# Altium schematic sheet MAIN.SchDoc
size A4; Engineer: Alisya K.; SheetNumber: 1; SheetTotal: 2; Project: LED Chaser; ENG_APP_DATE: --/--/--; DSN_APP_DATE: --/--/--; CHK_APP_DATE: --/--/--; SchBrief: Running LED lights circuit design.; SchTitle: MAIN
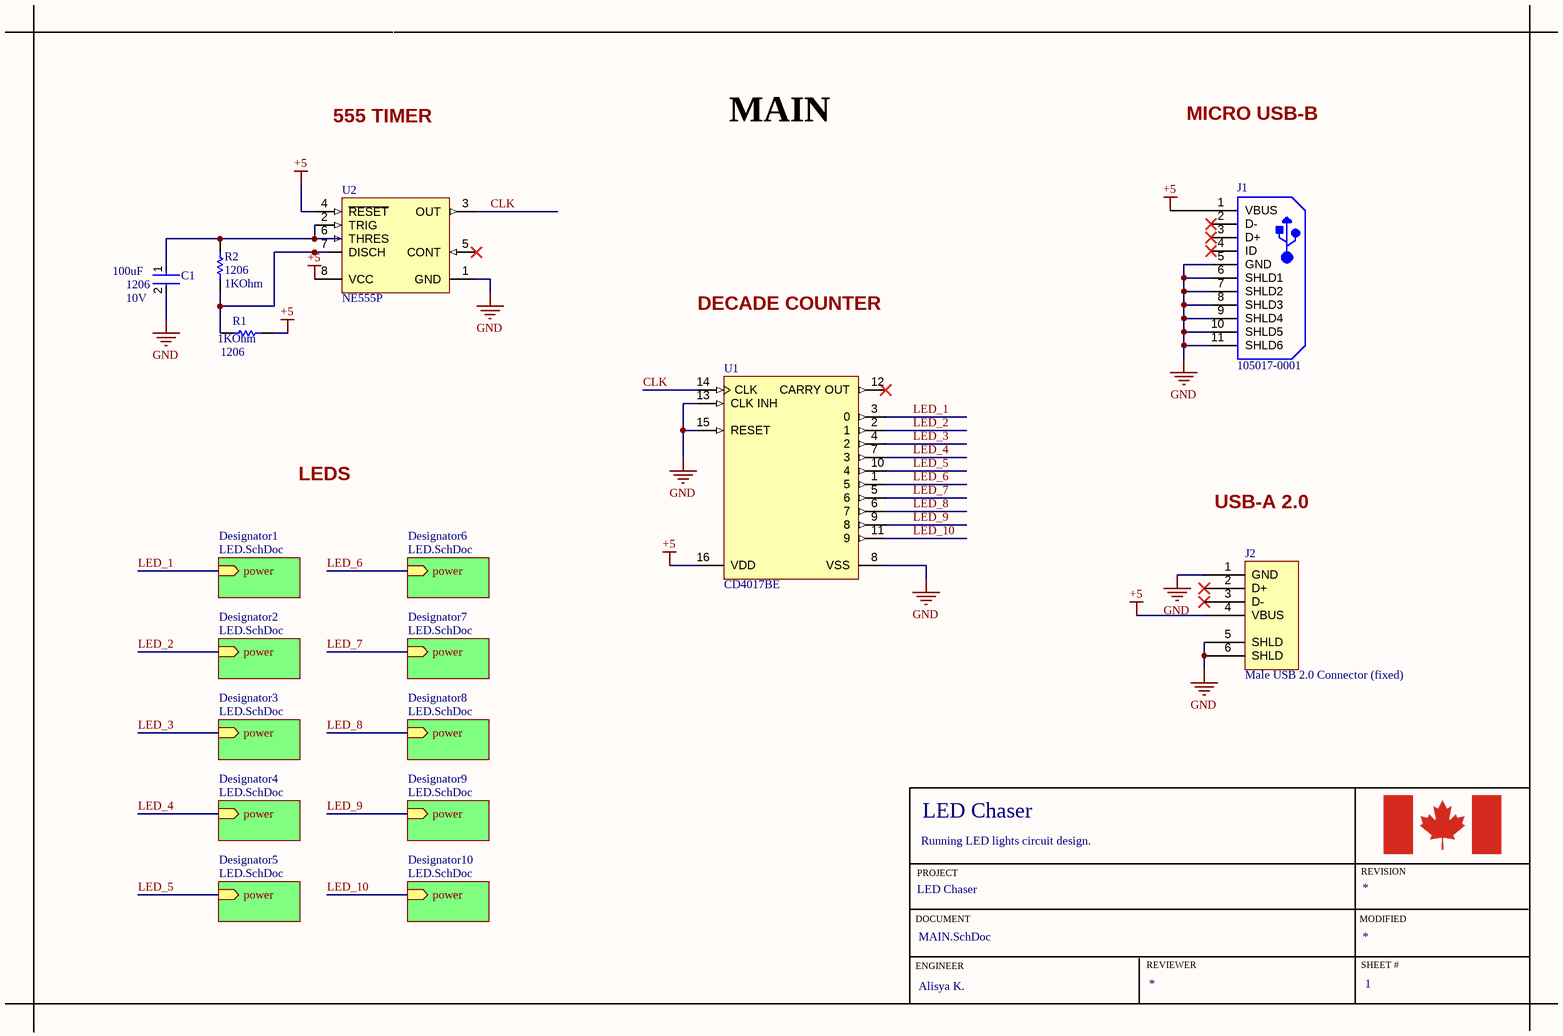
[diagram p0: MAIN.SchDoc]

## Parts
C1  Capacitance: 100uF  Voltage: 10V  Case/Package: 1206  [FP-C3216-160-0_3-IPC_C]  (hidden comment: C3216X5R1A107M160AC)
J1  105017-0001  [USB-MICRO-B_V]
J2  Male USB 2.0 Connector (fixed)  [MOLX-480-37-1000_V]
R1  Case Code (Imperial): 1206  Resistance: 1KOhm  [RESC3216X60X45ML15T20]  (hidden comment: CRCW12061K00FKEA)
R2  Case/Package: 1206  Resistance: 1KOhm  [RESC3216X60X45ML15T20]  (hidden comment: CRCW12061K00FKEA)
U1  CD4017BE  [N0016A]
U2  NE555P  [P0008A]

## Sub-sheets
Designator1 = LED.SchDoc: power (in)
Designator2 = LED.SchDoc: power (in)
Designator3 = LED.SchDoc: power (in)
Designator4 = LED.SchDoc: power (in)
Designator5 = LED.SchDoc: power (in)
Designator6 = LED.SchDoc: power (in)
Designator7 = LED.SchDoc: power (in)
Designator8 = LED.SchDoc: power (in)
Designator9 = LED.SchDoc: power (in)
Designator10 = LED.SchDoc: power (in)

## Nets
+5: J1.1(VBUS) J2.4(VBUS) R1.2 U1.16(VDD) U2.4(~{RESET}) U2.8(VCC)
GND: C1.2 J1.5(GND) J1.6(SHLD1) J1.7(SHLD2) J1.8(SHLD3) J1.9(SHLD4) J1.10(SHLD5) J1.11(SHLD6) J2.1(GND) J2.5(SHLD) J2.6(SHLD) U1.8(VSS) U1.13(CLK_INH) U1.15(RESET) U2.1(GND)
CLK: U1.14(CLK) U2.3(OUT)
LED_1: U1.3(0) ; sheet Designator1/power
LED_2: U1.2(1) ; sheet Designator2/power
LED_3: U1.4(2) ; sheet Designator3/power
LED_4: U1.7(3) ; sheet Designator4/power
LED_5: U1.10(4) ; sheet Designator5/power
LED_6: U1.1(5) ; sheet Designator6/power
LED_7: U1.5(6) ; sheet Designator7/power
LED_8: U1.6(7) ; sheet Designator8/power
LED_9: U1.9(8) ; sheet Designator9/power
LED_10: U1.11(9) ; sheet Designator10/power
NetC1_1: C1.1 R2.1 U2.2(TRIG) U2.6(THRES)
NetR1_1: R1.1 R2.2 U2.7(DISCH)

Not connected (* = marked no-connect by the designer): J1 2(D-)* 3(D+)* 4(ID)*; J2 2(D+)* 3(D-)*; U1 12(CARRY_OUT)*; U2 5(CONT)*

## Notes on the sheet
- 555 TIMER
- MICRO USB-B
- DECADE COUNTER
- LEDS
- USB-A 2.0
- DOCUMENT
- PROJECT
- MODIFIED
- REVISION
- ENGINEER
- REVIEWER
- SHEET #

## Library data of the parts
C1 = CMP-2000-05396-3: Multilayer Ceramic Capacitors 100uF ±20% 10V X5R SMD 1206; Voltage Rating (DC): 10V; Length: 3.2mm; Mount: Surface Mount; Depth: 1.6mm; Width: 1.6mm; Package Quantity: 1; Min Operating Temperature: -55°C; Packaging: Tape and Reel; Max Operating Temperature: 85°C; Dielectric: X5R; Construction: Flat; Case Code (Imperial): 1206; Thickness: 0.075inch; Radiation Hardening: No; RoHS Compliant: Yes; Series: C; Dielectric Material: Ceramic; REACH SVHC: No SVHC; Case Code (Metric): 3216; Weight: 0.000571oz; Height: 1.6mm; Voltage Rating: 10V; Termination: SMD/SMT; Lead Free: Lead Free; Tolerance: 20%; Resistor Type: Ceramic
J1 = CMP-2000-05827-1: Micro-USB B Receptacle, Right Angle, Bottom Mount, Surface Mount, with Solder Tabs, -30 to 85 degC, 5-Pin USB, RoHS, Tape and Reel; Manufacturer: Molex; Featured Product: Micro-USBConnectorsUSBConnectors; Other Names: WM1399DKR; Package Version: Rev. F, 12/2012; Number of Contacts: 5; Connector Type: USB-microB; Catalog Drawings: 1050170001; 3D Model: 105017-0001.stp; Mating Products: WM17145-ND-CABLEMICROUSBBTOSTDA1.0MWM17147-ND-CABLEMICROUSBBTOSTDA2.0MWM17146-ND-CABLEMICROUSBBTOSTDA1.5M; PCN Assembly/Origin: ResinSupplier21/Oct/2015; Voltage - Max: 30V; Online Catalog: Molex-MicroUSB; Manufacturer URL: http://www.molex.com/; Package Description: 5-Leads USB, Micro B, Body 7.5 x 5 mm, Pitch 0.65 mm; Datasheet URL: http://www.molex.com/elqNow/elqRedir.htm?ref=http://www.molex.com/webdocs/datasheets/pdf/en-us/1050170001_IO_CONNECTORS.pdf; Ingress Protection: -; Datasheet Version: 03/2016; Mounting Type: BoardCutout,SurfaceMount,RightAngle; Circuits: 5; Standard Package: 1; Package Reference: MICRO-B; Package URL: http://www.molex.com/pdm_docs/sd/1050170001_sd.pdf; Category: Connectors,Interconnects; Series: -; RoHS Information: 1050170001CertofCompliance; Features: Shielded,SolderRetention; Family: USB,DVI,HDMIConnectors; Specifications: -; Gender: Receptacle; Packaging: Digi-Reel®; Mounting Technology: SurfaceMount
J2 = CMP-002-00073-1
R1 R2 = CMP-2100-03616-1: Chip Resistor, 1 KOhm, +/- 1%, 0.25 W, -55 to 155 degC, 1206 (3216 Metric), RoHS, Tape and Reel; Manufacturer: Vishay Semiconductor; Power Rating: 250mW; Voltage Rating (DC): 200V; Temperature Coefficient: 100ppm/degreesC; Length: 3.2mm; Contact Plating: Tin; Package Quantity: 10; Datasheet URL: http://www.farnell.com/datasheets/1720486.pdf; Mount: SurfaceMount; Package Description: 2-Pin Surface Mount Device, Body 3.15 x 1.6 mm; Package Reference: 1206.0; Max Operating Temperature: 155degC; Lead Free: LeadFree; Weight: 0.000353oz; Military Standard: Not; Max Power Dissipation: 250mW; Case Code (Metric): 3216; Number of Terminations: 2; Tolerance: 1%; Width: 0.063inch; Termination: SMD/SMT; Number of Pins: 2; Min Operating Temperature: -55degC; Height: 0.55mm; Depth: 1.6mm; RoHSCompliant: true; Composition: ThickFilm; Packaging: TapeandReel; Manufacturer URL: http://www.vishay.com/; Voltage Rating: 200V; Radiation Hardening: No; REACH SVHC: Unknown; Datasheet Version: 41061.0
  R1: Case/Package: 1206
  R2: Case Code (Imperial): 1206
U1 = CMP-1623-00541-2: CMOS Decade Counter with 10 Decoded Outputs, N0016A, TUBE; Manufacturer: Texas Instruments; Schmitt Trigger: No; VCC(Max)(V): 18; tpd @ Nom Voltage(Max)(ns): 270; ICC @ Nom Voltage(Max)(mA): 0.03; Output Drive (IOL/IOH)(Max)(mA): 1.5/-1.5; VCC(Min)(V): 3; F @ Nom Voltage(Max)(Mhz): 8; Rating: Military; Technology Family: CD4000; Bits(#): 10; Inputs: 1; Type: Decade; Operating Temperature Range(C): -55 to 125; Output Type: CMOS; Code_JEDEC: MS-001; Function: Counter; PackageReference: N0016A; DatasheetVersion: SCHS027C; Input Type: CMOS; Generic Part Number: CD4017B; Voltage(Nom)(V): 10
U2 = CMP-2000-04954-1: Precision Timer, 4.5 to 16 V, 0 to 70 degC, 8-Pin DIP, Pb-Free, Tube; Manufacturer: TexasInstruments; Maximum High Level Output Current: -200mA; Number of Internal Timers: 1; Operating Supply Voltage: 5; Maximum Low Level Output Current: 200mA; Rad Hard: No; Packaging: Rail/Tube; Manufacturer URL: http://www.ti.com/; Package Reference: P8; Package Description: 8-Pin Double In-line Package, Body 9.59 x 6.35 mm, Pitch 2.54 mm; Package URL: http://www.ti.com/lit/ml/mpdi001b/mpdi001b.pdf; Type: Standard; Datasheet URL: http://www.ti.com/general/docs/lit/getliterature.tsp?genericPartNumber=NE555&fileType=pdf; Category: Timer; Package: 8PDIP; Datasheet Version: Rev. I, 09/2014